# Altium project Control_Board_Model_C.PrjPcb (part 3 of 4)

## Sheet BG95_Broadband_Modem.SchDoc: BG95 Broadband Modem
size A4; DocumentNumber: 16; SheetNumber: 16; SheetTotal: 51
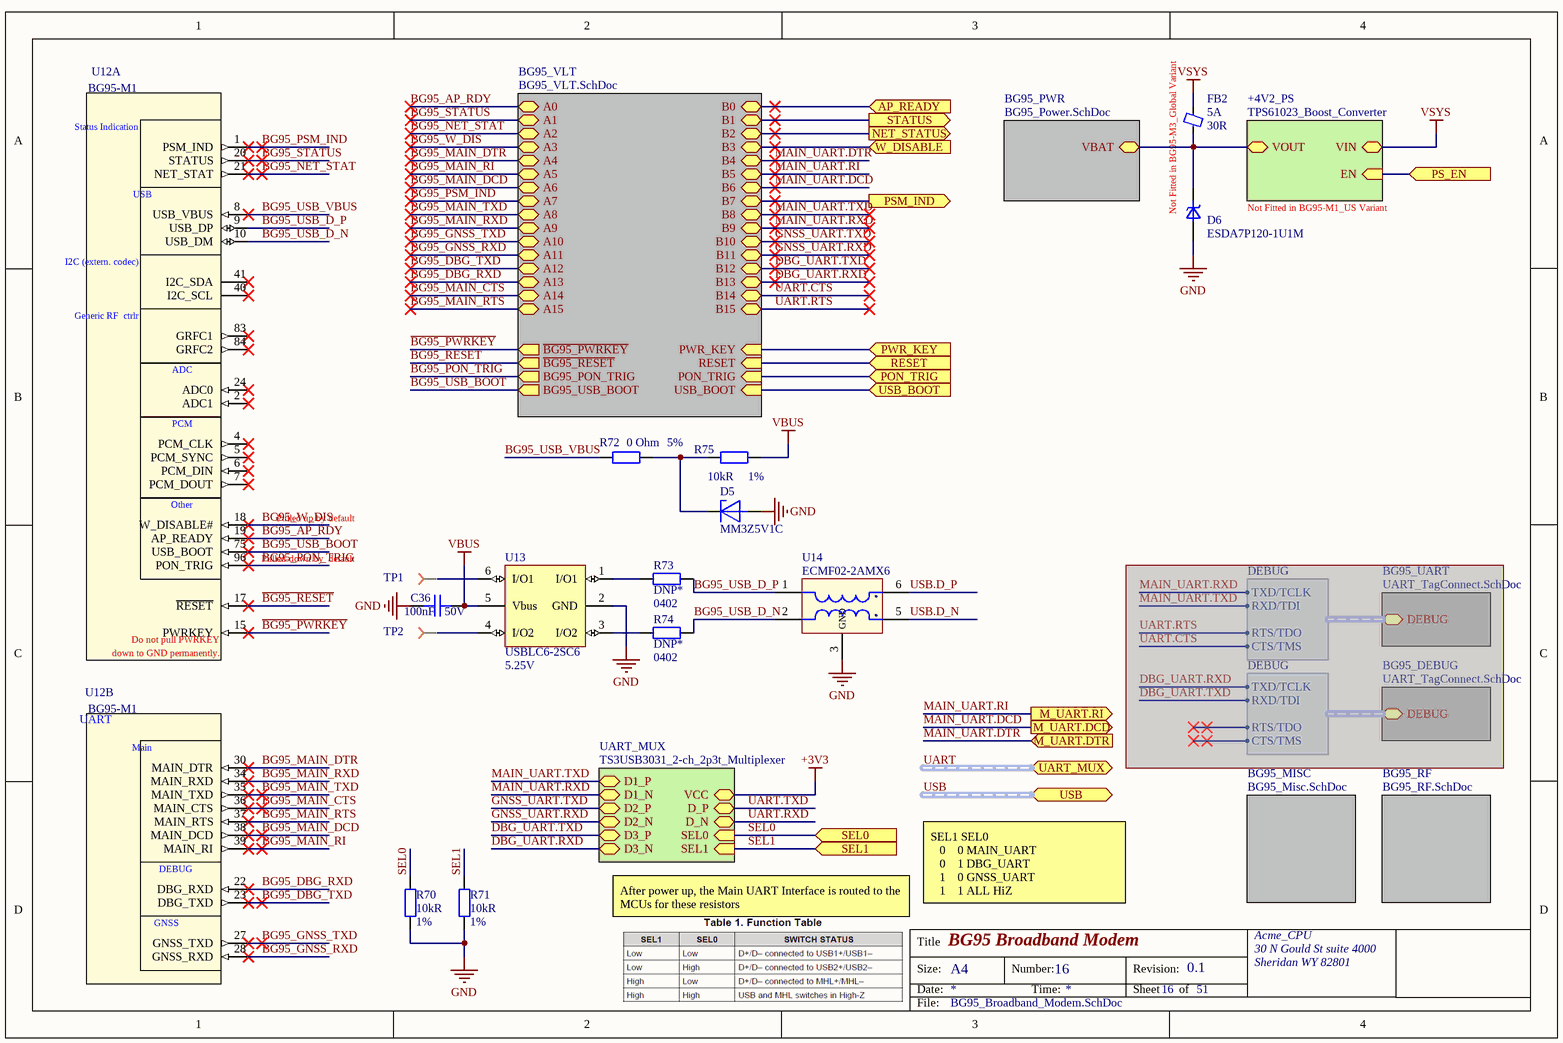
[diagram p6: BG95_Broadband_Modem.SchDoc]

### Parts
(Parts that share a designator on the sheet are numbered #1, #2 ... from top to bottom, then left to right.)
C36  Capacitance: 100nF  Voltage: 50V  [C0402]  (hidden comment: CAP CER 0.1UF 50V X7R 0402)
D5#2  MM3Z5V1C  [SOD-323F]
D6  ESDA7P120-1U1M  [ST_QFN_1610]
FB2  Not Fitted in BG95-M3_Global Variant  Current Rating: 5A  Impedance: 30R  [L0603]
R70  Resistance: 10kR  Tolerance: 1%  [R0402]  (hidden comment: RES SMD 10K OHM 1% 1/16W 0402)
R71  Resistance: 10kR  Tolerance: 1%  [R0402]  (hidden comment: RES SMD 10K OHM 1% 1/16W 0402)
R72  Tolerance: 5%  Resistance: 0 Ohm  [R0402]  (hidden comment: RES SMD 0 OHM JUMPER 1/16W 0402)
R73  DNP*  Case/Package: 0402  [R0402]  (no BOM)
R74  DNP*  Case/Package: 0402  [R0402]  (no BOM)
R75  Resistance: 10kR  Tolerance: 1%  [R0402]  (hidden comment: RES SMD 10K OHM 1% 1/16W 0402)
TP1  Test Point Pad  [Testpoint]  (value not drawn)  (no BOM)
TP2  Test Point Pad  [Testpoint]  (value not drawn)  (no BOM)
U12  BG95-M1  [BG95]  (parts A,B of 6)
U13  USBLC6-2SC6  Reverse Standoff Voltage: 5.25V  [SOT-23-6]
U14  ECMF02-2AMX6  [QFN-6L]

### Sub-sheets
+4V2_PS = TPS61023_Boost_Converter (file not in this document): VOUT, EN (in), VIN  | Variant: Not Fitted in BG95-M1_US Variant
BG95_DEBUG = UART_TagConnect.SchDoc (masked out) (file not in this document): DEBUG (harness DEBUG)  | Caption: BG95_DEBUG
BG95_MISC = BG95_Misc.SchDoc (file not in this document): no entries
BG95_PWR = BG95_Power.SchDoc (file not in this document): VBAT
BG95_RF = BG95_RF.SchDoc: no entries
BG95_UART = UART_TagConnect.SchDoc (masked out) (file not in this document): DEBUG (harness DEBUG)  | Caption: BG95_UART
BG95_VLT = BG95_VLT.SchDoc: B4, B5, B6, B1, A0, A7, B2, B0, A1, B3, A6, A2, A5, A3, A4, B7, PWR_KEY (in), RESET (in), ~{BG95_RESET} (out), ~{BG95_PWRKEY} (out), PON_TRIG (in), BG95_PON_TRIG (out), USB_BOOT (in), BG95_USB_BOOT (out), A10, A11, A12, A13, B8, A14, A15, B9, B12, B13, B14, B10, B11, B15, A8, A9
UART_MUX = TS3USB3031_2-ch_2p3t_Multiplexer (file not in this document): VCC, D_P (bidir), D_N (bidir), D1_N (bidir), D1_P (bidir), D2_P (bidir), D2_N (bidir), D3_N (bidir), D3_P (bidir), SEL0 (in), SEL1 (in)

### Ports
AP_READY (in), M_UART.DCD (out), M_UART.DTR (in), M_UART.RI (out), NET_STATUS (out), PON_TRIG (in), PS_EN (in), PSM_IND (out), PWR_KEY (in), RESET (in), SEL0 (in), SEL1 (in), STATUS (out), UART_MUX (harness UART), USB (harness USB), USB_BOOT (in), W_DISABLE (in)

### Harnesses
DEBUG: TXD/TCLK, RXD/TDI, RTS/TDO, CTS/TMS

### Nets
GND: C36.2 D5#2.2(A) D6.2(A) R70.2 R71.2 U13.2(GND) U14.3(GND)
VBUS: C36.1 R75.1 U13.5(Vbus)
VSYS: FB2.2 ; sheet +4V2_PS/VIN
~{BG95_PWRKEY}: U12.15(PWRKEY) ; sheet BG95_VLT/~{BG95_PWRKEY}
~{BG95_RESET}: U12.17(~{RESET}) ; sheet BG95_VLT/~{BG95_RESET}
B1_0: port AP_READY, sheet BG95_VLT/B0
B1_1: port STATUS, sheet BG95_VLT/B1
B1_2: port NET_STATUS, sheet BG95_VLT/B2
B1_3: port W_DISABLE, sheet BG95_VLT/B3
B1_7: port PSM_IND, sheet BG95_VLT/B7
BG95_1.IO0: port RESET, sheet BG95_VLT/RESET
BG95_1.IO1: port PWR_KEY, sheet BG95_VLT/PWR_KEY
BG95_1.IO2: port PON_TRIG, sheet BG95_VLT/PON_TRIG
BG95_1.IO3: port PS_EN, sheet +4V2_PS/EN
BG95_1.IO4: port USB_BOOT, sheet BG95_VLT/USB_BOOT
BG95_AP_RDY: U12.19(AP_READY) ; sheet BG95_VLT/A0  [project net A1_0]
BG95_DBG_RXD: U12.22(DBG_RXD) ; sheet BG95_VLT/A13  [project net A2_5]
BG95_DBG_TXD: U12.23(DBG_TXD) ; sheet BG95_VLT/A12  [project net A2_4]
BG95_GNSS_RXD: U12.28(GNSS_RXD) ; sheet BG95_VLT/A11  [project net A2_3]
BG95_GNSS_TXD: U12.27(GNSS_TXD) ; sheet BG95_VLT/A10  [project net A2_2]
BG95_MAIN_CTS: U12.36(MAIN_CTS) ; sheet BG95_VLT/A14  [project net A2_6]
BG95_MAIN_DCD: U12.38(MAIN_DCD) ; sheet BG95_VLT/A6  [project net A1_6]
BG95_MAIN_DTR: U12.30(MAIN_DTR) ; sheet BG95_VLT/A4  [project net A1_4]
BG95_MAIN_RI: U12.39(MAIN_RI) ; sheet BG95_VLT/A5  [project net A1_5]
BG95_MAIN_RTS: U12.37(MAIN_RTS) ; sheet BG95_VLT/A15  [project net A2_7]
BG95_MAIN_RXD: U12.34(MAIN_RXD) ; sheet BG95_VLT/A9  [project net A2_1]
BG95_MAIN_TXD: U12.35(MAIN_TXD) ; sheet BG95_VLT/A8  [project net A2_0]
BG95_NET_STAT: U12.21(NET_STAT) ; sheet BG95_VLT/A2  [project net A1_2]
BG95_PON_TRIG: U12.96(PON_TRIG) ; sheet BG95_VLT/BG95_PON_TRIG
BG95_PSM_IND: U12.1(PSM_IND) ; sheet BG95_VLT/A7  [project net A1_7]
BG95_STATUS: U12.20(STATUS) ; sheet BG95_VLT/A1  [project net A1_1]
BG95_USB_BOOT: U12.75(USB_BOOT) ; sheet BG95_VLT/BG95_USB_BOOT
BG95_USB_D_N: R74.1 U12.10(USB_DM) U14.2(INP2)
BG95_USB_D_P: R73.1 U12.9(USB_DP) U14.1(INP1)
BG95_USB_VBUS: R72.1 U12.8(USB_VBUS)
BG95_W_DIS: U12.18(W_DISABLE#) ; sheet BG95_VLT/A3  [project net A1_3]
DBG_UART.RXD: sheet BG95_VLT/B13, sheet UART_MUX/D3_N  [project net B2_5]
DBG_UART.TXD: sheet BG95_VLT/B12, sheet UART_MUX/D3_P  [project net B2_4]
GNSS_UART.RXD: sheet BG95_VLT/B11, sheet UART_MUX/D2_N  [project net B2_3]
GNSS_UART.TXD: sheet BG95_VLT/B10, sheet UART_MUX/D2_P  [project net B2_2]
MAIN_UART.DCD: port M_UART.DCD, sheet BG95_VLT/B6  [project net B1_6]
MAIN_UART.DTR: port M_UART.DTR, sheet BG95_VLT/B4  [project net B1_4]
MAIN_UART.RI: port M_UART.RI, sheet BG95_VLT/B5  [project net B1_5]
MAIN_UART.RXD: sheet BG95_VLT/B9, sheet UART_MUX/D1_N  [project net B2_1]
MAIN_UART.TXD: sheet BG95_VLT/B8, sheet UART_MUX/D1_P  [project net B2_0]
SEL0: R70.1 ; port SEL0, sheet UART_MUX/SEL0  [project net BG95_1.IO6]
SEL1: R71.1 ; port SEL1, sheet UART_MUX/SEL1  [project net BG95_1.IO7]
UART.CTS: sheet BG95_VLT/B14  [project net B2_6]
UART.RTS: sheet BG95_VLT/B15  [project net B2_7]
UART.RXD: sheet UART_MUX/D_N
UART.TXD: sheet UART_MUX/D_P
USB.D_N: U14.5(OUT2)
USB.D_P: U14.6(OUT1)
NetD5#2_1: D5#2.1(K) R72.2 R75.2
NetD6_1: D6.1(K) FB2.1 ; sheet BG95_PWR/VBAT, sheet +4V2_PS/VOUT
NetR73_2: R73.2 U13.1(I/O1)
NetR74_2: R74.2 U13.3(I/O2)
NetTP1_1: TP1.1 U13.6(I/O1)
NetTP2_1: TP2.1 U13.4(I/O2)

Not connected (* = marked no-connect by the designer): U12 2(ADC1)* 4(PCM_CLK)* 5(PCM_SYNC)* 6(PCM_DIN)* 7(PCM_DOUT)* 24(ADC0)* 40(I2C_SCL)* 41(I2C_SDA)* 83(GRFC1)* 84(GRFC2)*; U14 4(NC)

### Buses and harness runs
harness UART = port UART_MUX
harness USB = port USB

### Notes on the sheet
- Pulled up by default
- (near TP1) Pulled-down by  default
- After power up, the Main UART Interface is routed to the MCUs for these resistors
- SEL1	SEL0
  0	   0	MAIN_UART
  0	   1	DBG_UART
  1	   0	GNSS_UART
  1	   1	ALL HiZ
- Title
- Size:
- Date:
- A4
- Number:
- Time:
- Revision:
- Sheet
- of
- File:
- (in symbol MOD BG95 RX TXRX CELLULAR LTE/NAV SMD, part A) Status Indication; USB; I2C (extern. codec); Generic RF  ctrlr; ADC; PCM; Other; Do not pull PWRKEY; down to GND permanently.
- (in symbol MOD BG95 RX TXRX CELLULAR LTE/NAV SMD, part B) UART; Main; DEBUG; GNSS

### Library data of the parts
C36 = CAP CER 0.1UF 50V X7R 0402: 0.1µF ±10% 50V Ceramic Capacitor X7R 0402 (1005 Metric); Manufacturer: TDK; Manufacturer Part Number: CGA2B3X7R1H104K050BB; Supplier 1: Digi-Key; Stock 1: 2925303; Pricing 1: 1=0.17, 10=0.118, 50=0.0668, 100=0.0553, 500=0.0388, 1000=0.0321, 2500=0.0299, 5000=0.0273 (USD); Mount: Surface Mount; Case/Package: 0402; Weight: 2.3E-05oz; Case Code (Metric): 1005; Case Code (Imperial): 0402; Min Operating Temperature: -55°C; Max Operating Temperature: 125°C; Voltage Rating: 50V; Tolerance: 10%; Packaging: Tape and Reel; Package Quantity: 1; Voltage Rating (DC): 50V; Dielectric: X7R; Termination: SMD/SMT; Composition: Ceramic; Length: 1mm; Height: 0.5mm; Width: 0.02inch; Thickness: 0.022inch; Depth: 0.5mm; Ratings: AEC-Q200; REACH SVHC: No SVHC; Lead Free: Lead Free; ComponentLink1URL: http://product.tdk.com/capacitor/mlcc/en/documents/mlccspec_automotive_general_midvoltage_en.pdf?src-supplier=Future+Electronics; ComponentLink1Description: http://product.tdk.com/capacitor/mlcc/en/documents/mlccspec_automotive_general_midvoltage_en.pdf?src-supplier=Future+Electronics; ComponentLink2URL: http://www.farnell.com/datasheets/1807242.pdf?src-supplier=Element14; ComponentLink2Description: http://www.farnell.com/datasheets/1807242.pdf?src-supplier=Element14; ComponentLink3URL: http://www.mouser.com/ds/2/400/lcc_automotive_general_en-843974.pdf?src-supplier=Mouser; ComponentLink3Description: http://www.mouser.com/ds/2/400/lcc_automotive_general_en-843974.pdf?src-supplier=Mouser; ComponentLink4URL: http://www.farnell.com/datasheets/1936565.pdf?src-supplier=Element14; ComponentLink4Description: http://www.farnell.com/datasheets/1936565.pdf?src-supplier=Element14; ComponentLink5URL: http://www.farnell.com/datasheets/1735392.pdf?src-supplier=Element14; ComponentLink5Description: http://www.farnell.com/datasheets/1735392.pdf?src-supplier=Element14; Supplier Part Number 1: 445-6899-1-ND
D5#2 = DIODE ZENER 5.1V 200MW SOD323F: Zener Diode 5.1V 200mW ±5% Surface Mount SOD-323F; Manufacturer: ON Semiconductor / Fairchild; Impedance: 56R; Max Reverse Leakage Current: 1.8uA; Test Current: 5mA; Element Configuration: Single; Supplier 1: Digi-Key; Manufacturer Part Number: MM3Z5V1C; Stock 1: 27359; Pricing 1: 1=0.2, 10=0.167, 25=0.1396, 100=0.0682, 500=0.0569, 1000=0.0395 (USD); Mount: Surface Mount; Number of Pins: 2; Weight: 0.0276g; Min Operating Temperature: -65°C; Max Operating Temperature: 150°C; Packaging: Tape and Reel; Package Quantity: 1; Tolerance: 5%; Max Power Dissipation: 200mW; Zener Voltage: 5.1V; Voltage Tolerance: 5%; Power Dissipation: 200mW; Length: 1.3mm; Height: 1mm; Width: 1.7mm; Radiation Hardening: No; REACH SVHC: No SVHC; Lead Free: Lead Free; ComponentLink1URL: http://www.fairchildsemi.com/datasheets/MM/MM3Z10VC.pdf?src-supplier=Digi-Key; ComponentLink1Description: http://www.fairchildsemi.com/datasheets/MM/MM3Z10VC.pdf?src-supplier=Digi-Key; ComponentLink2URL: http://www.onsemi.com/pub/Collateral/MM3Z9V1C-D.pdf?src-supplier=Digi-Key; ComponentLink2Description: http://www.onsemi.com/pub/Collateral/MM3Z9V1C-D.pdf?src-supplier=Digi-Key; ComponentLink3URL: http://www.mouser.com/ds/2/149/MM3Z5V1C-195780.pdf?src-supplier=Mouser; ComponentLink3Description: http://www.mouser.com/ds/2/149/MM3Z5V1C-195780.pdf?src-supplier=Mouser; ComponentLink4URL: http://www.fairchildsemi.com/ds/MM/MM3Z9V1C.pdf?src-supplier=Avnet; ComponentLink4Description: http://www.fairchildsemi.com/ds/MM/MM3Z9V1C.pdf?src-supplier=Avnet; Supplier Part Number 1: MM3Z5V1CCT-ND
D6 = TVS DIODE ESDA7P120-1U1M 5.5V 11.5V 1610: 11.5V Clamp 120A (8/20µs) Ipp Tvs Diode Surface Mount 1610; Manufacturer: STMicroelectronics; Reverse Standoff Voltage: 5.5V; Number of Unidirectional Channels: 1; Min Breakdown Voltage: 6.4V; Peak Pulse Power: 1.4kW; Power Line Protection: No; Supplier 1: Digi-Key; Manufacturer Part Number: ESDA7P120-1U1M; Stock 1: 15775; Pricing 1: 1=0.35, 10=0.287, 25=0.2624, 100=0.1647, 250=0.1629, 500=0.1525, 1000=0.1037, 2500=0.0994 (USD); Packaging: Cut Tape; ComponentLink1URL: http://www.st.com/content/ccc/resource/technical/document/datasheet/group3/5e/7c/5d/76/3f/de/45/35/DM00359316/files/DM00359316.pdf/jcr:content/translations/en.DM00359316.pdf?src-supplier=Digi-Key; ComponentLink1Description: http://www.st.com/content/ccc/resource/technical/document/datasheet/group3/5e/7c/5d/76/3f/de/45/35/DM00359316/files/DM00359316.pdf/jcr:content/translations/en.DM00359316.pdf?src-supplier=Digi-Key; Supplier Part Number 1: 497-17159-1-ND; Mount: Surface Mount; Case/Package: 0603; Case Code (Imperial): 0603; Case Code (Metric): 1610; Min Operating Temperature: -55°C; Max Operating Temperature: 150°C; Composition: Zener; Clamping Voltage: 11.5V; Peak Pulse Current: 120A; ComponentLink2URL: http://www.farnell.com/datasheets/2815837.pdf?src-supplier=Newark; ComponentLink2Description: http://www.farnell.com/datasheets/2815837.pdf?src-supplier=Newark; ComponentLink3URL: http://www.farnell.com/datasheets/2815837.pdf?src-supplier=Farnell; ComponentLink3Description: http://www.farnell.com/datasheets/2815837.pdf?src-supplier=Farnell; ComponentLink4URL: http://www.farnell.com/datasheets/2815837.pdf?src-supplier=Element14; ComponentLink4Description: http://www.farnell.com/datasheets/2815837.pdf?src-supplier=Element14; ClassName: P109
FB2 = FERRITE BEAD 30 OHM 0603 1LN: 30 Ohms @ 100MHz 1 Power Line Ferrite Bead 0603 (1608 Metric) 5A 10mOhm; Manufacturer: TDK; Manufacturer Part Number: MPZ1608S300ATAH0; Tolerance: 25%; DC Resistance (DCR): 10mR; Supplier 1: Digi-Key; Stock 1: 93167; Pricing 1: 1=0.1, 10=0.079, 25=0.0716, 50=0.0644, 100=0.0472, 250=0.0343, 500=0.0315, 1000=0.0272 (USD); Case/Package: 0603; Case Code (Metric): 1608; Case Code (Imperial): 0603; Min Operating Temperature: -55°C; Max Operating Temperature: 125°C; Package Quantity: 4000; Packaging: Tape and Reel; Termination: SMD/SMT; Length: 0.063inch; Height: 0.6mm; Width: 0.031inch; Depth: 0.8mm; REACH SVHC: No SVHC; Lead Free: Lead Free; ComponentLink1URL: https://media.digikey.com/pdf/Data%20Sheets/TDK%20PDFs/MPZ_Series_Br.pdf?src-supplier=Digi-Key; ComponentLink1Description: https://media.digikey.com/pdf/Data%20Sheets/TDK%20PDFs/MPZ_Series_Br.pdf?src-supplier=Digi-Key; ComponentLink2URL: http://www.farnell.com/datasheets/1795297.pdf?src-supplier=Element14; ComponentLink2Description: http://www.farnell.com/datasheets/1795297.pdf?src-supplier=Element14; Supplier Part Number 1: 445-1562-6-ND; Max DC Current: 5A; Test Frequency: 100MHz; Revision: July-2002: Re-released for DXP Platform.; Mount: Surface Mount; Weight: 7.1E-05oz; Core Material: Ferrite
R70 R71 R75 = RES SMD 10K OHM 1% 1/16W 0402: 10 kOhms ±1% 0.063W, 1/16W Chip Resistor 0402 (1005 Metric) Moisture Resistant Thick Film; Manufacturer: Yageo; Manufacturer Part Number: RC0402FR-0710KP; Max Power Dissipation: 63mW; Temperature Coefficient: 150ppm/°C; Supplier 1: Digi-Key; Stock 1: 839368; Pricing 1: 1=0.1, 10=0.035, 100=0.014, 1000=0.0063, 2500=0.0055, 5000=0.0045 (USD); Case/Package: 0402; Case Code (Metric): 1005; Case Code (Imperial): 0402; Min Operating Temperature: -55°C; Max Operating Temperature: 155°C; Packaging: Tape and Reel; Composition: Thick Film; Number of Terminations: 2; Features: Moisture Resistant; Length: 0.039inch; Height: 0.016inch; Width: 0.02inch; ComponentLink1URL: http://www.yageo.com/NewPortal/yageodocoutput?fileName=/pdf/R-Chip/PYu-RC_51_RoHS_P_0.pdf&src-supplier=Digi-Key; ComponentLink1Description: http://www.yageo.com/NewPortal/yageodocoutput?fileName=/pdf/R-Chip/PYu-RC_51_RoHS_P_0.pdf&src-supplier=Digi-Key; Supplier Part Number 1: YAG1249CT-ND; Mount: Surface Mount
  R70 R71: ClassName: UART_MUX
R72 = RES SMD 0 OHM JUMPER 1/16W 0402: 0 Ohms Jumper 0.063W, 1/16W Chip Resistor 0402 (1005 Metric) Moisture Resistant Thick Film; Manufacturer: Yageo; Manufacturer Part Number: RC0402JR-070RL; Power Rating: 62.5mW; Voltage Rating: 50V; Max Power Dissipation: 63mW; Temperature Coefficient: 200ppm/°C; Supplier 1: Digi-Key; Stock 1: 46057148; Pricing 1: 1=0.1, 10=0.013, 25=0.0092, 50=0.0072, 100=0.0053, 250=0.004, 500=0.0032, 1000=0.0024, 5000=0.0017 (USD); Contact Plating: Tin,Matte; Case Code (Metric): 1005; Case Code (Imperial): 0402; Min Operating Temperature: -55°C; Max Operating Temperature: 155°C; Packaging: Tape and Reel; Composition: Thick Film; Package Quantity: 1; Number of Terminations: 2; Termination: SMD/SMT; Military Standard: Not; Features: Moisture Resistant; Length: 1mm; Height: 0.016inch; Width: 0.02inch; Depth: 0.5mm; Radiation Hardening: No; REACH SVHC: Unknown; Lead Free: Lead Free; ComponentLink1URL: http://www.yageo.com/documents/recent/PYu-RC_Group_51_RoHS_L_10.pdf?src-supplier=Digi-Key; ComponentLink1Description: http://www.yageo.com/documents/recent/PYu-RC_Group_51_RoHS_L_10.pdf?src-supplier=Digi-Key; ComponentLink2URL: http://www.yageo.com/documents/recent/PYu-RC0402_51_RoHS_L_6.pdf?src-supplier=Avnet+Europe; ComponentLink2Description: http://www.yageo.com/documents/recent/PYu-RC0402_51_RoHS_L_6.pdf?src-supplier=Avnet+Europe; ComponentLink3URL: http://www.farnell.com/datasheets/1018594.pdf?src-supplier=Element14; ComponentLink3Description: http://www.farnell.com/datasheets/1018594.pdf?src-supplier=Element14; ComponentLink4URL: https://www.verical.com/server-webapp/html/getDatasheet?partID=326379&src-supplier=Verical; ComponentLink4Description: https://www.verical.com/server-webapp/html/getDatasheet?partID=326379&src-supplier=Verical; ComponentLink5URL: http://www.farnell.com/datasheets/2167052.pdf?src-supplier=Element14; ComponentLink5Description: http://www.farnell.com/datasheets/2167052.pdf?src-supplier=Element14; Supplier Part Number 1: 311-0.0JRCT-ND; Case/Package: 0402; Mount: Surface Mount
R73 R74 = RES SMD NO BOM 0402: Placeholder for a 0402 resistor
TP1 TP2 = Test Point Pad: Test Point. There is nothing to buy or mount.; ClassName: TestPoint; CompType: TestPoint; Manufacturer: N/A; MountType: N/A; PackageReference: TetsPoint; PartNumber: N/A
U12 = MOD BG95 RX TXRX CELLULAR LTE/NAV SMD: LTE Cat M1, LTE Cat NB2 and EGPRS Transceiver Module Antenna Not Included Surface Mount; Manufacturer: QUECTEL; Part Description: IC MODULE BG95 102-LGA 19.9x23.6mm H2.2mm RO; Geometry.Height: 2.2mm; Value: BG95; Manufacturer Part Number: BG95-M1; PCB DECAL: BG95; Mount: Surface Mount
U13 = TVS DIODE 5.25V 17V SOT23-6: 17V Clamp 5A (8/20µs) Ipp Tvs Diode Surface Mount SOT-23-6; Manufacturer: STMicroelectronics; Data Rate: 480Mbps; Direction: Unidirectional,Bidirectional; Capacitance: 3.5pF; Operating Supply Voltage: 1.1V; Number of Elements: 1; Number of Channels: 2; Reverse Breakdown Voltage: 6V; Working Voltage: 5V; Power Line Protection: Yes; Test Current: 1mA; Max Reverse Leakage Current: 150nA; Element Configuration: Dual; Supplier 1: Digi-Key; Manufacturer Part Number: USBLC6-2SC6; Stock 1: 49245; Pricing 1: 1=0.47, 10=0.399, 25=0.3728, 100=0.2769, 250=0.263, 500=0.2162, 1000=0.1757 (USD); Mount: Surface Mount; Case/Package: SOT-23; Number of Pins: 6; Contact Plating: Tin,Matte; Min Operating Temperature: -40°C; Max Operating Temperature: 125°C; Packaging: Tape and Reel; Package Quantity: 3000; Polarity: Unidirectional,Bidirectional; Breakdown Voltage: 6V; Clamping Voltage: 17V; Termination: SMD/SMT; Number of Bidirectional Channels: 2; Min Breakdown Voltage: 6V; ESD Protection: Yes; Max Breakdown Voltage: 6V; Leakage Current: 150nA; Peak Pulse Current: 5A; Length: 3.05mm; Height: 1.3mm; Width: 1.75mm; Depth: 1.75mm; Radiation Hardening: No; REACH SVHC: No SVHC; Lead Free: Lead Free; ComponentLink1URL: http://www.farnell.com/datasheets/1738051.pdf?src-supplier=Element14; ComponentLink1Description: http://www.farnell.com/datasheets/1738051.pdf?src-supplier=Element14; ComponentLink2URL: http://www.st.com/content/ccc/resource/technical/document/datasheet/06/1d/48/9c/6c/20/4a/b2/CD00050750.pdf/files/CD00050750.pdf/jcr:content/translations/en.CD00050750.pdf?src-supplier=Mouser; ComponentLink2Description: http://www.st.com/content/ccc/resource/technical/document/datasheet/06/1d/48/9c/6c/20/4a/b2/CD00050750.pdf/files/CD00050750.pdf/jcr:content/translations/en.CD00050750.pdf?src-supplier=Mouser; ComponentLink3URL: http://www.st.com/web/en/resource/technical/document/datasheet/CD00050750.pdf?src-supplier=Future+Electronics; ComponentLink3Description: http://www.st.com/web/en/resource/technical/document/datasheet/CD00050750.pdf?src-supplier=Future+Electronics; ComponentLink4URL: http://www.st.com/content/ccc/resource/technical/document/datasheet/06/1d/48/9c/6c/20/4a/b2/CD00050750.pdf/files/CD00050750.pdf/jcr:content/translations/en.CD00050750.pdf?src-supplier=Verical; ComponentLink4Description: http://www.st.com/content/ccc/resource/technical/document/datasheet/06/1d/48/9c/6c/20/4a/b2/CD00050750.pdf/files/CD00050750.pdf/jcr:content/translations/en.CD00050750.pdf?src-supplier=Verical; ComponentLink5URL: http://datasheet.iiic.cc/stmicroelectronics/USBLC6-2SC6.pdf?src-supplier=IIIC; ComponentLink5Description: http://datasheet.iiic.cc/stmicroelectronics/USBLC6-2SC6.pdf?src-supplier=IIIC; ComponentLink6URL: http://www.produktinfo.conrad.com/datenblaetter/1100000-1199999/001184109-da-01-en-IC_ESD_PROTECTI_USBLC6_2SC6_SOT_23_6_STM.pdf?src-supplier=Conrad; ComponentLink6Description: http://www.produktinfo.conrad.com/datenblaetter/1100000-1199999/001184109-da-01-en-IC_ESD_PROTECTI_USBLC6_2SC6_SOT_23_6_STM.pdf?src-supplier=Conrad; Supplier Part Number 1: 497-5235-1-ND
U14 = CMC 200MA 2LN SMD ESD: 2 Line Common Mode Choke Surface Mount  200mA DCR 2.5Ohm; Manufacturer: STMicroelectronics; Number of Lines: 2; DC Resistance (DCR): 2.5R; Supplier 1: Digi-Key; Manufacturer Part Number: ECMF02-2AMX6; Stock 1: 23653; Pricing 1: 1=0.48, 10=0.418, 25=0.3888, 50=0.3288, 100=0.2989, 250=0.281, 500=0.2511, 1000=0.2033 (USD); Mount: Surface Mount; Case/Package: QFN; Number of Pins: 6; Min Operating Temperature: -40°C; Max Operating Temperature: 85°C; Packaging: Tape and Reel; Package Quantity: 1; Current: 200mA; Termination: Flat; Max Current Rating: 200mA; Current Rating: 200mA; Length: 1.75mm; Height: 0.022inch; Width: 0.059inch; Depth: 1.55mm; Radiation Hardening: No; Lead Free: Lead Free; REACH SVHC: No SVHC; ComponentLink1URL: http://www.st.com/web/en/resource/technical/document/datasheet/CD00282307.pdf?src-supplier=Future+Electronics; ComponentLink1Description: http://www.st.com/web/en/resource/technical/document/datasheet/CD00282307.pdf?src-supplier=Future+Electronics; ComponentLink2URL: http://www.st.com/content/ccc/resource/technical/document/datasheet/3a/28/cf/d0/31/63/48/8c/CD00282307.pdf/files/CD00282307.pdf/jcr:content/translations/en.CD00282307.pdf?src-supplier=Digi-Key; ComponentLink2Description: http://www.st.com/content/ccc/resource/technical/document/datasheet/3a/28/cf/d0/31/63/48/8c/CD00282307.pdf/files/CD00282307.pdf/jcr:content/translations/en.CD00282307.pdf?src-supplier=Digi-Key; ComponentLink3URL: http://www.mouser.com/ds/2/389/ecmf02-2amx6-954491.pdf?src-supplier=Mouser; ComponentLink3Description: http://www.mouser.com/ds/2/389/ecmf02-2amx6-954491.pdf?src-supplier=Mouser; ComponentLink4URL: https://www.verical.com/server-webapp/html/getDatasheet?partID=259862&src-supplier=Verical; ComponentLink4Description: https://www.verical.com/server-webapp/html/getDatasheet?partID=259862&src-supplier=Verical; Supplier Part Number 1: 497-10773-1-ND

## Sheet BG95_RF.SchDoc: BG95 RF Interface
size A4; DocumentNumber: 17; SheetNumber: 17; SheetTotal: 51
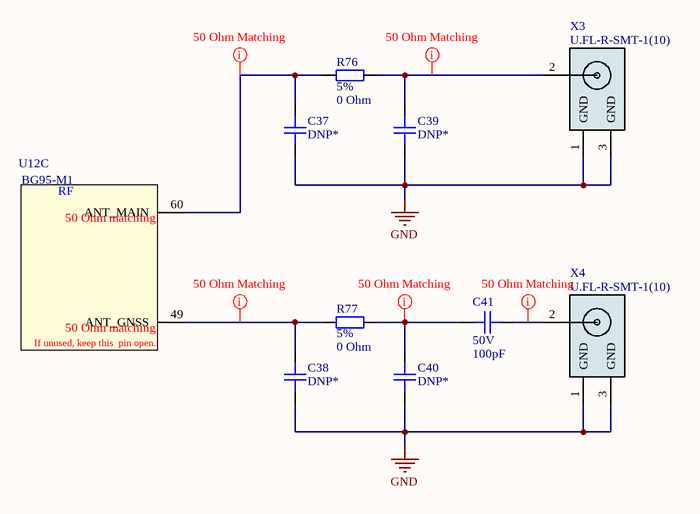
[diagram p7: BG95_RF.SchDoc]

### Parts
C37  DNP*  [C0402]  (no BOM)
C38  DNP*  [C0402]  (no BOM)
C39  DNP*  [C0402]  (no BOM)
C40  DNP*  [C0402]  (no BOM)
C41  Voltage: 50V  Capacitance: 100pF  [C0402]  (hidden comment: C 100pF 50V C0G, NP0 0402)
R76  Tolerance: 5%  Resistance: 0 Ohm  [R0402]  (hidden comment: RES SMD 0 OHM JUMPER 1/16W 0402)
R77  Tolerance: 5%  Resistance: 0 Ohm  [R0402]  (hidden comment: RES SMD 0 OHM JUMPER 1/16W 0402)
U12  BG95-M1  [BG95]  (part C of 6)
X3  U.FL-R-SMT-1(10)  [CONN U.FL RCPT STR 50 OHM SMD]
X4  U.FL-R-SMT-1(10)  [CONN U.FL RCPT STR 50 OHM SMD]

### Nets
GND: C37.1 C38.1 C39.1 C40.1 X3.1(GND) X3.3(GND) X4.1(GND) X4.3(GND)
NetC37_2: C37.2 R76.1 U12.60(ANT_MAIN)
NetC38_2: C38.2 R77.1 U12.49(ANT_GNSS)
NetC39_2: C39.2 R76.2 X3.2(Signal)
NetC40_2: C40.2 C41.1 R77.2
NetC41_2: C41.2 X4.2(Signal)

### Layout directives
rule Width Constraint [Pref Impedance = 50.00ohms    Min Impedance = 45.00ohms    Max Impedance = 55.00ohms]: NetC37_2, NetC38_2, NetC39_2, NetC40_2, NetC41_2

### Notes on the sheet
- Title
- Size:
- Date:
- A4
- Number:
- Time:
- Revision:
- Sheet
- of
- File:
- (in symbol MOD BG95 RX TXRX CELLULAR LTE/NAV SMD, part C) RF; 50 Ohm matching; If unused, keep this  pin open.

### Library data of the parts
C37-C40 = CAP CER NO_BOM 0402: Placeholder for a 0402 capacitor; ClassName: P109
C41 = C 100pF 50V C0G, NP0 0402: 100pF ±5% 50V Ceramic Capacitor C0G, NP0 0402 (1005 Metric); Manufacturer: Yageo; Manufacturer Part Number: CC0402JRNPO9BN101; Temperature Coefficient: 30ppm/°C; Insulation Resistance: 100GR; Supplier 1: Digi-Key; Stock 1: 4235236; Pricing 1: 1=0.1, 10=0.02, 100=0.0089, 500=0.0064, 1000=0.005, 2500=0.0046, 5000=0.0042 (USD); Mount: Surface Mount; Case/Package: 0402; Number of Pins: 2; Case Code (Imperial): 0402; Case Code (Metric): 1005; Dielectric Material: Ceramic; Min Operating Temperature: -55°C; Max Operating Temperature: 125°C; Tolerance: 5%; Voltage Rating (DC): 50V; Packaging: Tape and Reel; Package Quantity: 1; Termination: SMD/SMT; Composition: Ceramic; Length: 1mm; Height: 0.5mm; Width: 0.5mm; Thickness: 0.022inch; Depth: 0.5mm; Radiation Hardening: No; REACH SVHC: No SVHC; Lead Free: Lead Free; ComponentLink1URL: http://www.farnell.com/datasheets/2213336.pdf?src-supplier=Newark; ComponentLink1Description: http://www.farnell.com/datasheets/2213336.pdf?src-supplier=Newark; ComponentLink2URL: http://www.yageo.com/documents/recent/UPY-GP_NP0_16V-to-50V_16.pdf?src-supplier=Digi-Key; ComponentLink2Description: http://www.yageo.com/documents/recent/UPY-GP_NP0_16V-to-50V_16.pdf?src-supplier=Digi-Key; ComponentLink3URL: http://documents.rs-components.com/techlib://itc_doclist_GB.htm?stockno=6698684&src-supplier=RSComponents; ComponentLink3Description: http://documents.rs-components.com/techlib://itc_doclist_GB.htm?stockno=6698684&src-supplier=RSComponents; ComponentLink4URL: http://www.yageo.com/documents/recent/UPY-GP_NP0_16V-to-50V_8.pdf?src-supplier=Avnet+Europe; ComponentLink4Description: http://www.yageo.com/documents/recent/UPY-GP_NP0_16V-to-50V_8.pdf?src-supplier=Avnet+Europe; ComponentLink5URL: http://www.farnell.com/datasheets/1443161.pdf?src-supplier=Element14; ComponentLink5Description: http://www.farnell.com/datasheets/1443161.pdf?src-supplier=Element14; ComponentLink6URL: http://www.farnell.com/datasheets/2213336.pdf?src-supplier=Element14; ComponentLink6Description: http://www.farnell.com/datasheets/2213336.pdf?src-supplier=Element14; Supplier Part Number 1: 311-1024-1-ND; Dielectric: C0G; Voltage Rating: 50V
R76 R77 = RES SMD 0 OHM JUMPER 1/16W 0402: as R72 on sheet BG95_Broadband_Modem; Supplier 1: Digi-Key; Stock 1: 46057148; Pricing 1: 1=0.1, 10=0.013, 25=0.0092, 50=0.0072, 100=0.0053, 250=0.004, 500=0.0032, 1000=0.0024, 5000=0.0017 (USD); Contact Plating: Tin,Matte; Case Code (Metric): 1005; Case Code (Imperial): 0402; Min Operating Temperature: -55°C; Max Operating Temperature: 155°C; Packaging: Tape and Reel; Composition: Thick Film; Package Quantity: 1; Number of Terminations: 2; Termination: SMD/SMT; Military Standard: Not; Features: Moisture Resistant; Length: 1mm; Height: 0.016inch; Width: 0.02inch; Depth: 0.5mm; Radiation Hardening: No; REACH SVHC: Unknown; Lead Free: Lead Free; ComponentLink1URL: http://www.yageo.com/documents/recent/PYu-RC_Group_51_RoHS_L_10.pdf?src-supplier=Digi-Key; ComponentLink1Description: http://www.yageo.com/documents/recent/PYu-RC_Group_51_RoHS_L_10.pdf?src-supplier=Digi-Key; ComponentLink2URL: http://www.yageo.com/documents/recent/PYu-RC0402_51_RoHS_L_6.pdf?src-supplier=Avnet+Europe; ComponentLink2Description: http://www.yageo.com/documents/recent/PYu-RC0402_51_RoHS_L_6.pdf?src-supplier=Avnet+Europe; ComponentLink3URL: http://www.farnell.com/datasheets/1018594.pdf?src-supplier=Element14; ComponentLink3Description: http://www.farnell.com/datasheets/1018594.pdf?src-supplier=Element14; ComponentLink4URL: https://www.verical.com/server-webapp/html/getDatasheet?partID=326379&src-supplier=Verical; ComponentLink4Description: https://www.verical.com/server-webapp/html/getDatasheet?partID=326379&src-supplier=Verical; ComponentLink5URL: http://www.farnell.com/datasheets/2167052.pdf?src-supplier=Element14; ComponentLink5Description: http://www.farnell.com/datasheets/2167052.pdf?src-supplier=Element14; Supplier Part Number 1: 311-0.0JRCT-ND; Case/Package: 0402; ClassName: P109; Mount: Surface Mount
U12 = MOD BG95 RX TXRX CELLULAR LTE/NAV SMD: as U12 on sheet BG95_Broadband_Modem; Manufacturer Part Number: BG95-M1; PCB DECAL: BG95; Mount: Surface Mount
X3 X4 = CONN U.FL RCPT STR 50 OHM SMD: U.FL (UMCC) Connector Receptacle, Male Pin 50Ohm Surface Mount Solder; Manufacturer: Hirose; Body Material: Bronze; Body Plating: Silver; Dielectric Material: Polymer; Impedance: 50R; Connector Type: Coaxial,Receptacle,Male Pin; Frequency: 6GHz; Insulation Resistance: 500MR; Wire/Cable Type: Coaxial; Supplier 1: Digi-Key; Manufacturer Part Number: U.FL-R-SMT-1(10); Stock 1: 19543; Pricing 1: 1=1.31, 10=1.15, 25=1.0824, 50=1.0374, 100=0.9922, 250=0.902, 500=0.8118, 1000=0.7216 (USD); Mount: Surface Mount; Contact Material: Brass,Bronze; Contact Plating: Gold; Housing Color: Beige; Min Operating Temperature: -40°C; Max Operating Temperature: 90°C; Termination: Solder; Orientation: Straight; Packaging: Tape and Reel; Package Quantity: 2500; Fastening Type: Snap; Max Frequency: 6GHz; Gender: Male; Length: 3mm; Depth: 3.1mm; Radiation Hardening: No; REACH SVHC: No SVHC; Lead Free: Lead Free; ComponentLink1URL: http://www.farnell.com/datasheets/91524.pdf?src-supplier=Element14; ComponentLink1Description: http://www.farnell.com/datasheets/91524.pdf?src-supplier=Element14; ComponentLink2URL: http://uk.rs-online.com/webdocs/1363/0900766b81363563.pdf?src-supplier=RSComponents; ComponentLink2Description: http://uk.rs-online.com/webdocs/1363/0900766b81363563.pdf?src-supplier=RSComponents; ComponentLink3URL: http://www.farnell.com/datasheets/2691132.pdf?src-supplier=Element14; ComponentLink3Description: http://www.farnell.com/datasheets/2691132.pdf?src-supplier=Element14; Supplier Part Number 1: H11891CT-ND; ClassName: P109

## Sheet BG95_VLT.SchDoc: BG95 Voltage Level Translator
size A4; DocumentNumber: 20; SheetNumber: 20; SheetTotal: 51
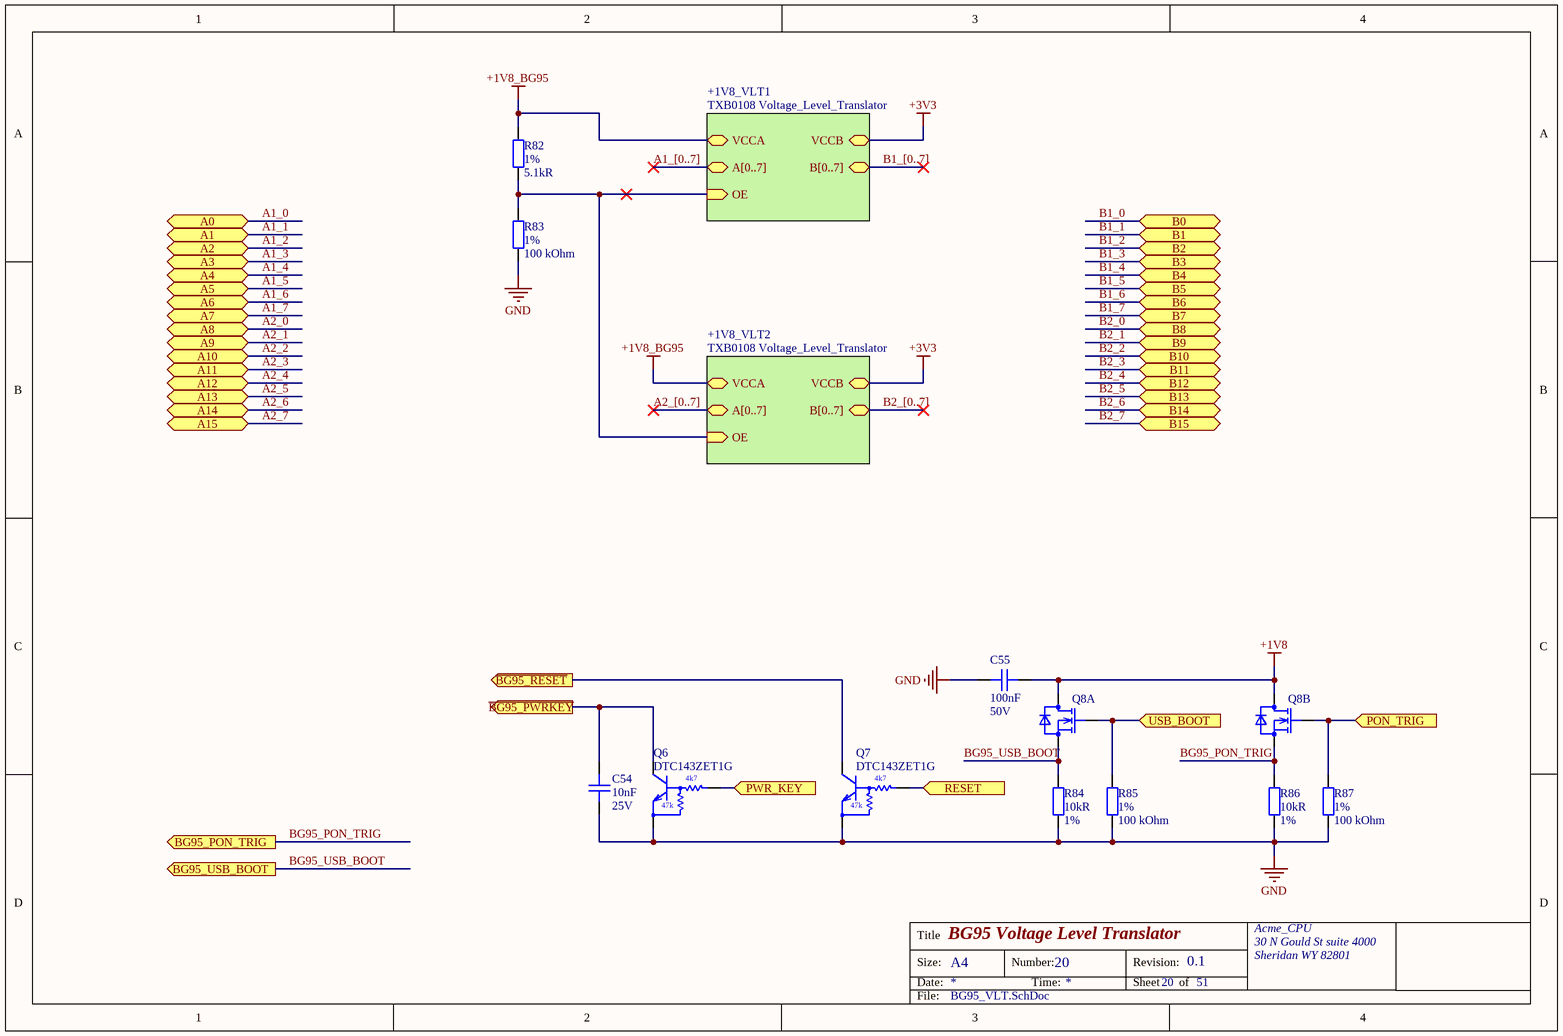
[diagram p8: BG95_VLT.SchDoc]

### Parts
C54  Capacitance: 10nF  Voltage: 25V  [C0402]  (hidden comment: CAP CER 10nF 25V X7R 10% 0402)
C55  Capacitance: 100nF  Voltage: 50V  [C0402]  (hidden comment: CAP CER 0.1UF 50V X7R 0402)
Q6  DTC143ZET1G  [SOT-416FL_ONS]
Q7  DTC143ZET1G  [SOT-416FL_ONS]
Q8  DMN32D2LV-7  [SON_400UV-7_DIO]  (value not drawn)  (parts A,B of 2)
R82  Tolerance: 1%  Resistance: 5.1kR  [R0402]  (hidden comment: RES SMD 5.1K OHM 1% 1/16W 0402)
R83  Tolerance: 1%  Resistance: 100 kOhm  [R0402]  (hidden comment: RES SMD 100K OHM 1% 1/16W 0402)
R84  Resistance: 10kR  Tolerance: 1%  [R0402]  (hidden comment: RES SMD 10K OHM 1% 1/16W 0402)
R85  Tolerance: 1%  Resistance: 100 kOhm  [R0402]  (hidden comment: RES SMD 100K OHM 1% 1/16W 0402)
R86  Resistance: 10kR  Tolerance: 1%  [R0402]  (hidden comment: RES SMD 10K OHM 1% 1/16W 0402)
R87  Tolerance: 1%  Resistance: 100 kOhm  [R0402]  (hidden comment: RES SMD 100K OHM 1% 1/16W 0402)

### Sub-sheets
+1V8_VLT1 = TXB0108 Voltage_Level_Translator (file not in this document): A[0..7], B[0..7], VCCA, VCCB, OE (in)
+1V8_VLT2 = TXB0108 Voltage_Level_Translator (file not in this document): A[0..7], B[0..7], VCCA, VCCB, OE (in)

### Ports
A0, A1, A2, A3, A4, A5, A6, A7, A8, A9, A10, A11, A12, A13, A14, A15, B0, B1, B2, B3, B4, B5, B6, B7, B8, B9, B10, B11, B12, B13, B14, B15, BG95_PON_TRIG (out), BG95_USB_BOOT (out), PON_TRIG (in), PWR_KEY (in), RESET (in), USB_BOOT (in), ~{BG95_PWRKEY} (out), ~{BG95_RESET} (out)

### Nets
+1V8: C55.2 Q8.3(D) Q8.6(D)
+1V8_BG95: R82.1 ; sheet +1V8_VLT1/VCCA, sheet +1V8_VLT2/VCCA
+3V3: sheet +1V8_VLT1/VCCB, sheet +1V8_VLT2/VCCB
GND: C54.1 C55.1 Q6.2(E) Q7.2(E) R83.1 R84.2 R85.1 R86.2 R87.1
~{BG95_PWRKEY}: C54.2 Q6.3(C) ; port ~{BG95_PWRKEY}
~{BG95_RESET}: Q7.3(C) ; port ~{BG95_RESET}
B1_0: port B0
B1_1: port B1
B1_2: port B2
B1_3: port B3
B1_4: port B4
B1_5: port B5
B1_6: port B6
B1_7: port B7
B2_0: port B8
B2_1: port B9
B2_2: port B10
B2_3: port B11
B2_4: port B12
B2_5: port B13
B2_6: port B14
B2_7: port B15
BG95_1.IO0: Q7.1(B) ; port RESET
BG95_1.IO1: Q6.1(B) ; port PWR_KEY
BG95_1.IO2: Q8.5(G) R87.2 ; port PON_TRIG
BG95_1.IO4: Q8.2(G) R85.2 ; port USB_BOOT
BG95_PON_TRIG: Q8.4(S) R86.1 ; port BG95_PON_TRIG
BG95_USB_BOOT: Q8.1(S) R84.1 ; port BG95_USB_BOOT
NetR82_2: R82.2 R83.2 ; sheet +1V8_VLT1/OE, sheet +1V8_VLT2/OE

### Buses and harness runs
bus A1_[0..7] = sheet +1V8_VLT1/A[0..7]
bus A2_[0..7] = sheet +1V8_VLT2/A[0..7]
bus B1_[0..7] = sheet +1V8_VLT1/B[0..7]
bus B2_[0..7] = sheet +1V8_VLT2/B[0..7]

### Notes on the sheet
- Title
- Size:
- Date:
- A4
- Number:
- Time:
- Revision:
- Sheet
- of
- File:
- (in symbol TRANS PREBIAS NPN 200MW SC75) 4k7; 47k

### Library data of the parts
C54 = CAP CER 10nF 25V X7R 10% 0402: Manufacturer: Kyocera AVX; Manufacturer Part Number: 04023C103KAT2A; Dissipation Factor: 12.5%; Insulation Resistance: 100GR; Supplier 1: Digi-Key; Stock 1: 1015537; Pricing 1: 1=0.1, 10=0.034, 50=0.0182, 100=0.0149, 500=0.0107, 1000=0.0084, 2500=0.0076, 5000=0.007 (USD); Mount: Surface Mount; Case/Package: 0402; Case Code (Metric): 1005; Case Code (Imperial): 0402; Min Operating Temperature: -55°C; Max Operating Temperature: 125°C; Tolerance: 10%; Dielectric: X7R; Voltage Rating (DC): 25V; Packaging: Tape and Reel; Voltage Rating: 25V; Package Quantity: 1; Termination: SMD/SMT; Length: 1mm; Height: 0.56mm; Depth: 0.5mm; Width: 0.02inch; Thickness: 0.022inch; Radiation Hardening: No; REACH SVHC: No SVHC; Lead Free: Lead Free; ComponentLink1URL: http://www.farnell.com/datasheets/2237835.pdf?src-supplier=Element14; ComponentLink1Description: http://www.farnell.com/datasheets/2237835.pdf?src-supplier=Element14; ComponentLink2URL: http://catalogs.avx.com/SurfaceMount.pdf?src-supplier=Digi-Key; ComponentLink2Description: http://catalogs.avx.com/SurfaceMount.pdf?src-supplier=Digi-Key; ComponentLink3URL: http://www.alliedelec.com/m/d/a24bb5190bea413b2ff164816f55e87c.pdf?src-supplier=Allied+Electronics; ComponentLink3Description: http://www.alliedelec.com/m/d/a24bb5190bea413b2ff164816f55e87c.pdf?src-supplier=Allied+Electronics; ComponentLink4URL: http://uk.rs-online.com/webdocs/13ec/0900766b813ece35.pdf?src-supplier=RSComponents; ComponentLink4Description: http://uk.rs-online.com/webdocs/13ec/0900766b813ece35.pdf?src-supplier=RSComponents; Supplier Part Number 1: 478-1113-1-ND; ClassName: P109
C55 = CAP CER 0.1UF 50V X7R 0402: as C36 on sheet BG95_Broadband_Modem; Supplier 1: Digi-Key; Stock 1: 2925303; Pricing 1: 1=0.17, 10=0.118, 50=0.0668, 100=0.0553, 500=0.0388, 1000=0.0321, 2500=0.0299, 5000=0.0273 (USD); Mount: Surface Mount; Case/Package: 0402; Weight: 2.3E-05oz; Case Code (Metric): 1005; Case Code (Imperial): 0402; Min Operating Temperature: -55°C; Max Operating Temperature: 125°C; Voltage Rating: 50V; Tolerance: 10%; Packaging: Tape and Reel; Package Quantity: 1; Voltage Rating (DC): 50V; Dielectric: X7R; Termination: SMD/SMT; Composition: Ceramic; Length: 1mm; Height: 0.5mm; Width: 0.02inch; Thickness: 0.022inch; Depth: 0.5mm; Ratings: AEC-Q200; REACH SVHC: No SVHC; Lead Free: Lead Free; ComponentLink1URL: http://product.tdk.com/capacitor/mlcc/en/documents/mlccspec_automotive_general_midvoltage_en.pdf?src-supplier=Future+Electronics; ComponentLink1Description: http://product.tdk.com/capacitor/mlcc/en/documents/mlccspec_automotive_general_midvoltage_en.pdf?src-supplier=Future+Electronics; ComponentLink2URL: http://www.farnell.com/datasheets/1807242.pdf?src-supplier=Element14; ComponentLink2Description: http://www.farnell.com/datasheets/1807242.pdf?src-supplier=Element14; ComponentLink3URL: http://www.mouser.com/ds/2/400/lcc_automotive_general_en-843974.pdf?src-supplier=Mouser; ComponentLink3Description: http://www.mouser.com/ds/2/400/lcc_automotive_general_en-843974.pdf?src-supplier=Mouser; ComponentLink4URL: http://www.farnell.com/datasheets/1936565.pdf?src-supplier=Element14; ComponentLink4Description: http://www.farnell.com/datasheets/1936565.pdf?src-supplier=Element14; ComponentLink5URL: http://www.farnell.com/datasheets/1735392.pdf?src-supplier=Element14; ComponentLink5Description: http://www.farnell.com/datasheets/1735392.pdf?src-supplier=Element14; Supplier Part Number 1: 445-6899-1-ND
Q6 Q7 = TRANS PREBIAS NPN 200MW SC75: Pre-Biased Bipolar Transistor (BJT) NPN - Pre-Biased 50V 100mA  200mW Surface Mount SC-75, SOT-416; Manufacturer: ON Semiconductor; Element Configuration: Single; hFE Min: 80; Collector Emitter Saturation Voltage: 250mV; Emitter Base Voltage (VEBO): 6V; Supplier 1: Digi-Key; Manufacturer Part Number: DTC143ZET1G; Stock 1: 44167; Pricing 1: 1=0.14, 10=0.129, 25=0.1224, 100=0.0539, 500=0.0423, 1000=0.0294 (USD); Number of Pins: 3; Min Operating Temperature: -55°C; Max Operating Temperature: 150°C; Package Quantity: 1; Packaging: Tape and Reel; Max Power Dissipation: 200mW; Power Dissipation: 200mW; Voltage Rating (DC): 50V; Current Rating: 100mA; Length: 1.65mm; Height: 0.8mm; Width: 0.9mm; Radiation Hardening: No; REACH SVHC: No SVHC; Lead Free: Lead Free; ComponentLink1URL: http://www.onsemi.com/pub/Collateral/DTC143Z-D.PDF?src-supplier=Digi-Key; ComponentLink1Description: http://www.onsemi.com/pub/Collateral/DTC143Z-D.PDF?src-supplier=Digi-Key; ComponentLink2URL: http://www.onsemi.com/pub_link/Collateral/DTC124E-D.PDF?src-supplier=Avnet+Europe; ComponentLink2Description: http://www.onsemi.com/pub_link/Collateral/DTC124E-D.PDF?src-supplier=Avnet+Europe; ComponentLink3URL: https://www.verical.com/server-webapp/html/getDatasheet?partID=60141&src-supplier=Verical; ComponentLink3Description: https://www.verical.com/server-webapp/html/getDatasheet?partID=60141&src-supplier=Verical; Supplier Part Number 1: DTC143ZET1GOSCT-ND; Case/Package: SC; Contact Plating: Tin,Matte; Collector Emitter Voltage (VCEO): 50V; Max Collector Current: 100mA; Collector Emitter Breakdown Voltage: 50V; Max Output Current: 100mA; Operating Supply Voltage: 50V; Max Breakdown Voltage: 50V; Polarity: NPN; Continuous Collector Current: 100mA; Halogen Free: Halogen Free; ClassName: P109; Mount: Surface Mount
Q8 = ARRAY MOSFET 2N-CH 30V 0.4A SOT-563: Mosfet Array 2 N-Channel (Dual) 30V 400mA 400mW Surface Mount SOT-563; Manufacturer: Diodes; Gate to Source Voltage (Vgs): 10V; Rds On Max: 1.2R; Input Capacitance: 39pF; Number of Channels: 2; Supplier 1: Digi-Key; Manufacturer Part Number: DMN32D2LV-7; Stock 1: 141366; Pricing 1: 1=0.39, 10=0.338, 25=0.3152, 100=0.234, 500=0.1827, 1000=0.1485 (USD); Mount: Surface Mount; Min Operating Temperature: -55°C; Max Operating Temperature: 150°C; Continuous Drain Current (ID): 400mA; Package Quantity: 3000; Packaging: Tape and Reel; Drain to Source Voltage (Vdss): 30V; Max Power Dissipation: 400mW; Drain to Source Breakdown Voltage: 30V; Drain to Source Resistance: 1.2R; Element Configuration: Dual; FET Type: 2 N-Channel; Length: 1.6mm; Height: 0.6mm; Width: 1.2mm; Radiation Hardening: No; REACH SVHC: No SVHC; ComponentLink1URL: https://www.diodes.com/assets/Datasheets/ds31121.pdf?src-supplier=Digi-Key; ComponentLink1Description: https://www.diodes.com/assets/Datasheets/ds31121.pdf?src-supplier=Digi-Key; ComponentLink2URL: http://www.mouser.com/ds/2/115/ds31121-89496.pdf?src-supplier=Mouser; ComponentLink2Description: http://www.mouser.com/ds/2/115/ds31121-89496.pdf?src-supplier=Mouser; ComponentLink3URL: http://www.diodes.com///datasheets/ds31121.pdf?src-supplier=Avnet; ComponentLink3Description: http://www.diodes.com///datasheets/ds31121.pdf?src-supplier=Avnet; Supplier Part Number 1: DMN32D2LV-7DICT-ND; Case/Package: SOT-563; Weight: 0.000106oz; Polarity: N-CHANNEL; Series: -; ClassName: P109; ClassName: TCPP
R82 = RES SMD 5.1K OHM 1% 1/16W 0402: 5.1 kOhms ±1% 0.063W, 1/16W Chip Resistor 0402 (1005 Metric) Moisture Resistant Thick Film; Manufacturer: Yageo; Manufacturer Part Number: RC0402FR-075K1L; Max Power Dissipation: 63mW; Temperature Coefficient: 100ppm/°C; Voltage Rating (DC): 50V; Supplier 1: Digi-Key; Stock 1: 19803; Pricing 1: 1=0.1, 10=0.016, 100=0.0064, 1000=0.0029, 2500=0.0025, 5000=0.0021 (USD); Case/Package: 0402; Case Code (Metric): 1005; Case Code (Imperial): 0402; Min Operating Temperature: -55°C; Max Operating Temperature: 155°C; Packaging: Tape and Reel; Composition: Thick Film; Number of Terminations: 2; Package Quantity: 1; Power Rating: 63mW; Military Standard: Not; Features: Moisture Resistant; Voltage Rating: 50V; Termination: SMD/SMT; Working Voltage: 50V; Length: 1mm; Height: 0.016inch; Width: 0.02inch; Depth: 0.5mm; Lead Free: Lead Free; REACH SVHC: Unknown; ComponentLink1URL: https://www.verical.com/server-webapp/html/getDatasheet?partID=323636&src-supplier=Verical; ComponentLink1Description: https://www.verical.com/server-webapp/html/getDatasheet?partID=323636&src-supplier=Verical; ComponentLink2URL: http://www.yageo.com/documents/recent/PYu-RC_Group_51_RoHS_L_10.pdf?src-supplier=Digi-Key; ComponentLink2Description: http://www.yageo.com/documents/recent/PYu-RC_Group_51_RoHS_L_10.pdf?src-supplier=Digi-Key; ComponentLink3URL: http://www.farnell.com/datasheets/2167052.pdf?src-supplier=Element14; ComponentLink3Description: http://www.farnell.com/datasheets/2167052.pdf?src-supplier=Element14; ComponentLink4URL: http://www.yageo.com/documents/recent/PYu-RC0402_51_RoHS_L_6_r.pdf?src-supplier=Future+Electronics; ComponentLink4Description: http://www.yageo.com/documents/recent/PYu-RC0402_51_RoHS_L_6_r.pdf?src-supplier=Future+Electronics; ComponentLink5URL: http://www.yageo.com/documents/recent/PYu-RC0402_51_RoHS_L_6_r.pdf?src-supplier=Mouser; ComponentLink5Description: http://www.yageo.com/documents/recent/PYu-RC0402_51_RoHS_L_6_r.pdf?src-supplier=Mouser; ComponentLink6URL: http://www.farnell.com/datasheets/1018594.pdf?src-supplier=Element14; ComponentLink6Description: http://www.farnell.com/datasheets/1018594.pdf?src-supplier=Element14; Supplier Part Number 1: 311-5.10KLRCT-ND; Mount: Surface Mount
R83 R85 R87 = RES SMD 100K OHM 1% 1/16W 0402: 100 kOhms ±1% 0.063W, 1/16W Chip Resistor 0402 (1005 Metric) Moisture Resistant Thick Film; Manufacturer: Yageo; Manufacturer Part Number: RC0402FR-07100KL; Temperature Coefficient: 100ppm/°C; Power Rating: 63mW; Voltage Rating: 50V; Supplier 1: Digi-Key; Stock 1: 47448883; Pricing 1: 1=0.1, 10=0.016, 100=0.0064, 1000=0.0029, 2500=0.0025, 5000=0.0021 (USD); Case Code (Metric): 1005; Case Code (Imperial): 0402; Min Operating Temperature: -55°C; Max Operating Temperature: 155°C; Composition: Thick Film; Packaging: Tape and Reel; Package Quantity: 1; Number of Terminations: 2; Termination: SMD/SMT; Military Standard: Not; Max Power Dissipation: 63mW; Working Voltage: 50V; Features: Moisture Resistant; Length: 0.039inch; Height: 0.016inch; Width: 0.02inch; Depth: 0.5mm; REACH SVHC: No SVHC; Lead Free: Lead Free; ComponentLink1URL: http://www.yageo.com/documents/recent/PYu-RC_Group_51_RoHS_L_10.pdf?src-supplier=Digi-Key; ComponentLink1Description: http://www.yageo.com/documents/recent/PYu-RC_Group_51_RoHS_L_10.pdf?src-supplier=Digi-Key; ComponentLink2URL: http://www.farnell.com/datasheets/1018594.pdf?src-supplier=Element14; ComponentLink2Description: http://www.farnell.com/datasheets/1018594.pdf?src-supplier=Element14; ComponentLink3URL: http://www.yageo.com/documents/recent/PYu-RC_Group_51_RoHS_L_9.pdf?src-supplier=Verical; ComponentLink3Description: http://www.yageo.com/documents/recent/PYu-RC_Group_51_RoHS_L_9.pdf?src-supplier=Verical; ComponentLink4URL: http://www.yageo.com/documents/recent/PYu-RC_Group_51_RoHS_L_9.pdf?src-supplier=Mouser; ComponentLink4Description: http://www.yageo.com/documents/recent/PYu-RC_Group_51_RoHS_L_9.pdf?src-supplier=Mouser; ComponentLink5URL: http://documents.rs-components.com/techlib://itc_doclist_GB.htm?stockno=6185797&src-supplier=RSComponents; ComponentLink5Description: http://documents.rs-components.com/techlib://itc_doclist_GB.htm?stockno=6185797&src-supplier=RSComponents; Supplier Part Number 1: 311-100KLRDKR-ND; Case/Package: 0402; Mount: Surface Mount
  R85 R87: ClassName: P109
R84 R86 = RES SMD 10K OHM 1% 1/16W 0402: as R70 on sheet BG95_Broadband_Modem; Supplier 1: Digi-Key; Stock 1: 839368; Pricing 1: 1=0.1, 10=0.035, 100=0.014, 1000=0.0063, 2500=0.0055, 5000=0.0045 (USD); Case/Package: 0402; Case Code (Metric): 1005; Case Code (Imperial): 0402; Min Operating Temperature: -55°C; Max Operating Temperature: 155°C; Packaging: Tape and Reel; Composition: Thick Film; Number of Terminations: 2; Features: Moisture Resistant; Length: 0.039inch; Height: 0.016inch; Width: 0.02inch; ComponentLink1URL: http://www.yageo.com/NewPortal/yageodocoutput?fileName=/pdf/R-Chip/PYu-RC_51_RoHS_P_0.pdf&src-supplier=Digi-Key; ComponentLink1Description: http://www.yageo.com/NewPortal/yageodocoutput?fileName=/pdf/R-Chip/PYu-RC_51_RoHS_P_0.pdf&src-supplier=Digi-Key; Supplier Part Number 1: YAG1249CT-ND; ClassName: P109; Mount: Surface Mount

## Sheet Audio_Module.SchDoc: Audio Module
size A4; DocumentNumber: 9; SheetNumber: 9; SheetTotal: 51
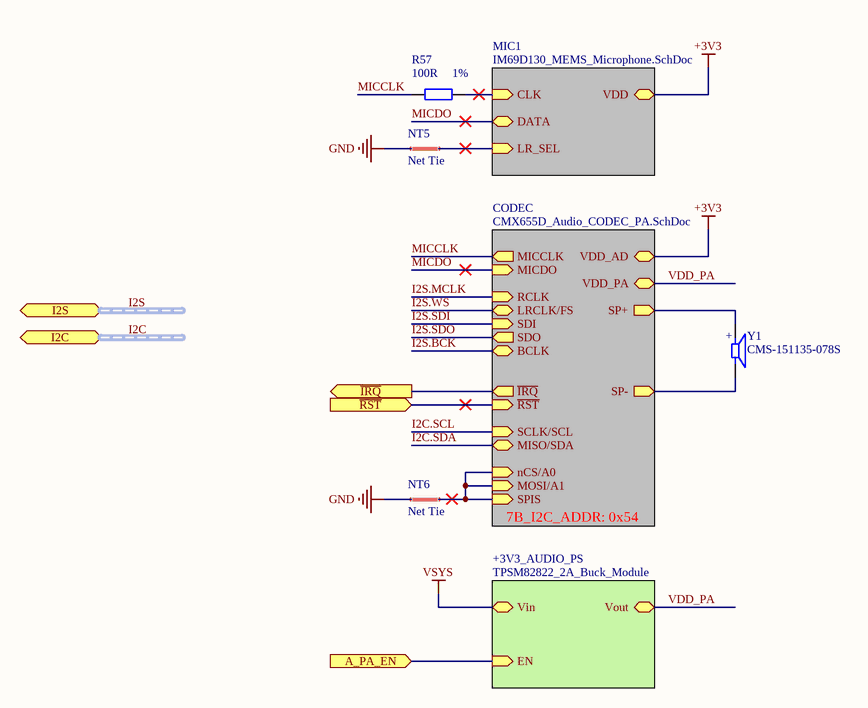
[diagram p9: Audio_Module.SchDoc]

### Parts
NT5  Net Tie  [Net Tie 6x30mil]  (net tie, no BOM)
NT6  Net Tie  [Net Tie 6x30mil]  (net tie, no BOM)
R57  Tolerance: 1%  Resistance: 100R  [0402R]  (hidden comment: RES SMD 100 OHM 1% 1/16W 0402)
Y1  CMS-151135-078S  [SPKR_CMS-151135-078S]

### Sub-sheets
+3V3_AUDIO_PS = TPSM82822_2A_Buck_Module (file not in this document): Vout, Vin, EN (in)
CODEC = CMX655D_Audio_CODEC_PA.SchDoc: SP+ (out), SP- (out), VDD_AD, VDD_PA, MICCLK (out), MICDO (in), ~{IRQ} (out), ~{RST} (in), SCLK/SCL (in), MISO/SDA (bidir), MOSI/A1 (in), nCS/A0 (in), SPIS (in), RCLK (in), LRCLK/FS (bidir), SDI (in), SDO (out), BCLK (bidir)  | 7B_I2C_ADDR: 0x54
MIC1 = IM69D130_MEMS_Microphone.SchDoc (file not in this document): CLK (in), DATA, VDD, LR_SEL (in)

### Ports
A_PA_EN (in), I2C (harness I2C), I2S (harness I2S), ~{IRQ} (out), ~{RST} (in)

### Nets
+3V3: sheet MIC1/VDD, sheet CODEC/VDD_AD
GND: NT5.1 NT6.1
~{CMX655_IRQ}: port ~{IRQ}, sheet CODEC/~{IRQ}
~{CMX655_RST}: port ~{RST}, sheet CODEC/~{RST}
GPIO.IO7: port A_PA_EN, sheet +3V3_AUDIO_PS/EN
MICCLK: R57.2 ; sheet CODEC/MICCLK
MICDO: sheet MIC1/DATA, sheet CODEC/MICDO
VDD_PA: sheet CODEC/VDD_PA, sheet +3V3_AUDIO_PS/Vout
NetNT5_2: NT5.2 ; sheet MIC1/LR_SEL
NetNT6_2: NT6.2 ; sheet CODEC/MOSI/A1, sheet CODEC/nCS/A0, sheet CODEC/SPIS
NetR57_1: R57.1 ; sheet MIC1/CLK
NetU7_1: Y1.M ; sheet CODEC/SP-
NetU7_23: Y1.P ; sheet CODEC/SP+

### Buses and harness runs
harness I2C = port I2C
harness I2S = port I2S

### Notes on the sheet
- Title
- Size:
- Date:
- A4
- Number:
- Time:
- Revision:
- Sheet
- of
- File:
- (in symbol SPEAKER CMS-151135-078S 15 X 11 MM ENCLOSED) +

### Library data of the parts
NT5 NT6 = Net Tie Line: ClassName: Net Tie
R57 = RES SMD 100 OHM 1% 1/16W 0402: 100 Ohms ±1% 0.063W, 1/16W Chip Resistor 0402 (1005 Metric) Moisture Resistant Thick Film; Manufacturer: Yageo; Manufacturer Part Number: RC0402FR-07100RL; Power Rating: 62.5mW; Voltage Rating: 50V; Temperature Coefficient: 100ppm/°C; Supplier 1: Digi-Key; Stock 1: 16989760; Pricing 1: 1=0.1, 10=0.016, 100=0.0064, 1000=0.0029, 2500=0.0025, 5000=0.0021 (USD); Case/Package: 0402; Number of Pins: 2; Case Code (Imperial): 0402; Case Code (Metric): 1005; Min Operating Temperature: -55°C; Max Operating Temperature: 155°C; Voltage Rating (DC): 50V; Packaging: Tape and Reel; Termination: SMD/SMT; Composition: Thick Film; Military Standard: Not; Length: 1mm; Height: 0.32mm; Width: 0.5mm; Depth: 0.5mm; REACH SVHC: No SVHC; Lead Free: Lead Free; ComponentLink1URL: http://www.farnell.com/datasheets/2167052.pdf?src-supplier=Element14; ComponentLink1Description: http://www.farnell.com/datasheets/2167052.pdf?src-supplier=Element14; ComponentLink2URL: http://www.yageo.com/documents/recent/PYu-RC_Group_51_RoHS_L_9.pdf?src-supplier=Mouser; ComponentLink2Description: http://www.yageo.com/documents/recent/PYu-RC_Group_51_RoHS_L_9.pdf?src-supplier=Mouser; ComponentLink3URL: http://www.yageo.com/documents/recent/PYu-RC0402_51_RoHS_L_6_r.pdf?src-supplier=Future+Electronics; ComponentLink3Description: http://www.yageo.com/documents/recent/PYu-RC0402_51_RoHS_L_6_r.pdf?src-supplier=Future+Electronics; ComponentLink4URL: https://www.verical.com/server-webapp/html/getDatasheet?partID=329466&src-supplier=Verical; ComponentLink4Description: https://www.verical.com/server-webapp/html/getDatasheet?partID=329466&src-supplier=Verical; ComponentLink5URL: http://www.farnell.com/datasheets/1018594.pdf?src-supplier=Element14; ComponentLink5Description: http://www.farnell.com/datasheets/1018594.pdf?src-supplier=Element14; ComponentLink6URL: http://documents.rs-components.com/techlib://itc_doclist_GB.htm?stockno=6185810&src-supplier=RSComponents; ComponentLink6Description: http://documents.rs-components.com/techlib://itc_doclist_GB.htm?stockno=6185810&src-supplier=RSComponents; Supplier Part Number 1: 311-100LRDKR-ND
Y1 = SPEAKER CMS-151135-078S 15 X 11 MM ENCLOSED: 8 Ohms General Purpose Speaker 700mW 100Hz ~ 20kHz Top Rectangular; Manufacturer: CUI; Sensing Method: Magnetic; Self Resonant Frequency: 550Hz; Impedance: 8R; Max Power Dissipation: 1W; Supplier 1: Digi-Key; Manufacturer Part Number: CMS-151135-078S; Stock 1: 1971; Pricing 1: 1=2.07, 10=1.72, 25=1.5888, 50=1.4932, 100=1.4013, 500=1.2016, 1000=1.17 (USD); Packaging: Tray; ComponentLink1URL: https://www.cui.com/product/resource/digikeypdf/CMS-15113-078x.pdf?src-supplier=Digi-Key; ComponentLink1Description: https://www.cui.com/product/resource/digikeypdf/CMS-15113-078x.pdf?src-supplier=Digi-Key; Supplier Part Number 1: 102-4616-ND; Shape: Rectangular; Type: General Purpose; Power Rating: 700mW